# EAGLE design espurna-wd (EAGLE 9.4.2)
PROJECT_AUTHOR: tinkerman.cat <xose.perez@gmail.com>; PROJECT_LICENSE: CC-BY-SA 4.0; PROJECT_NAME: ESPURNA-H; PROJECT_VERSION: 0.8.20171028
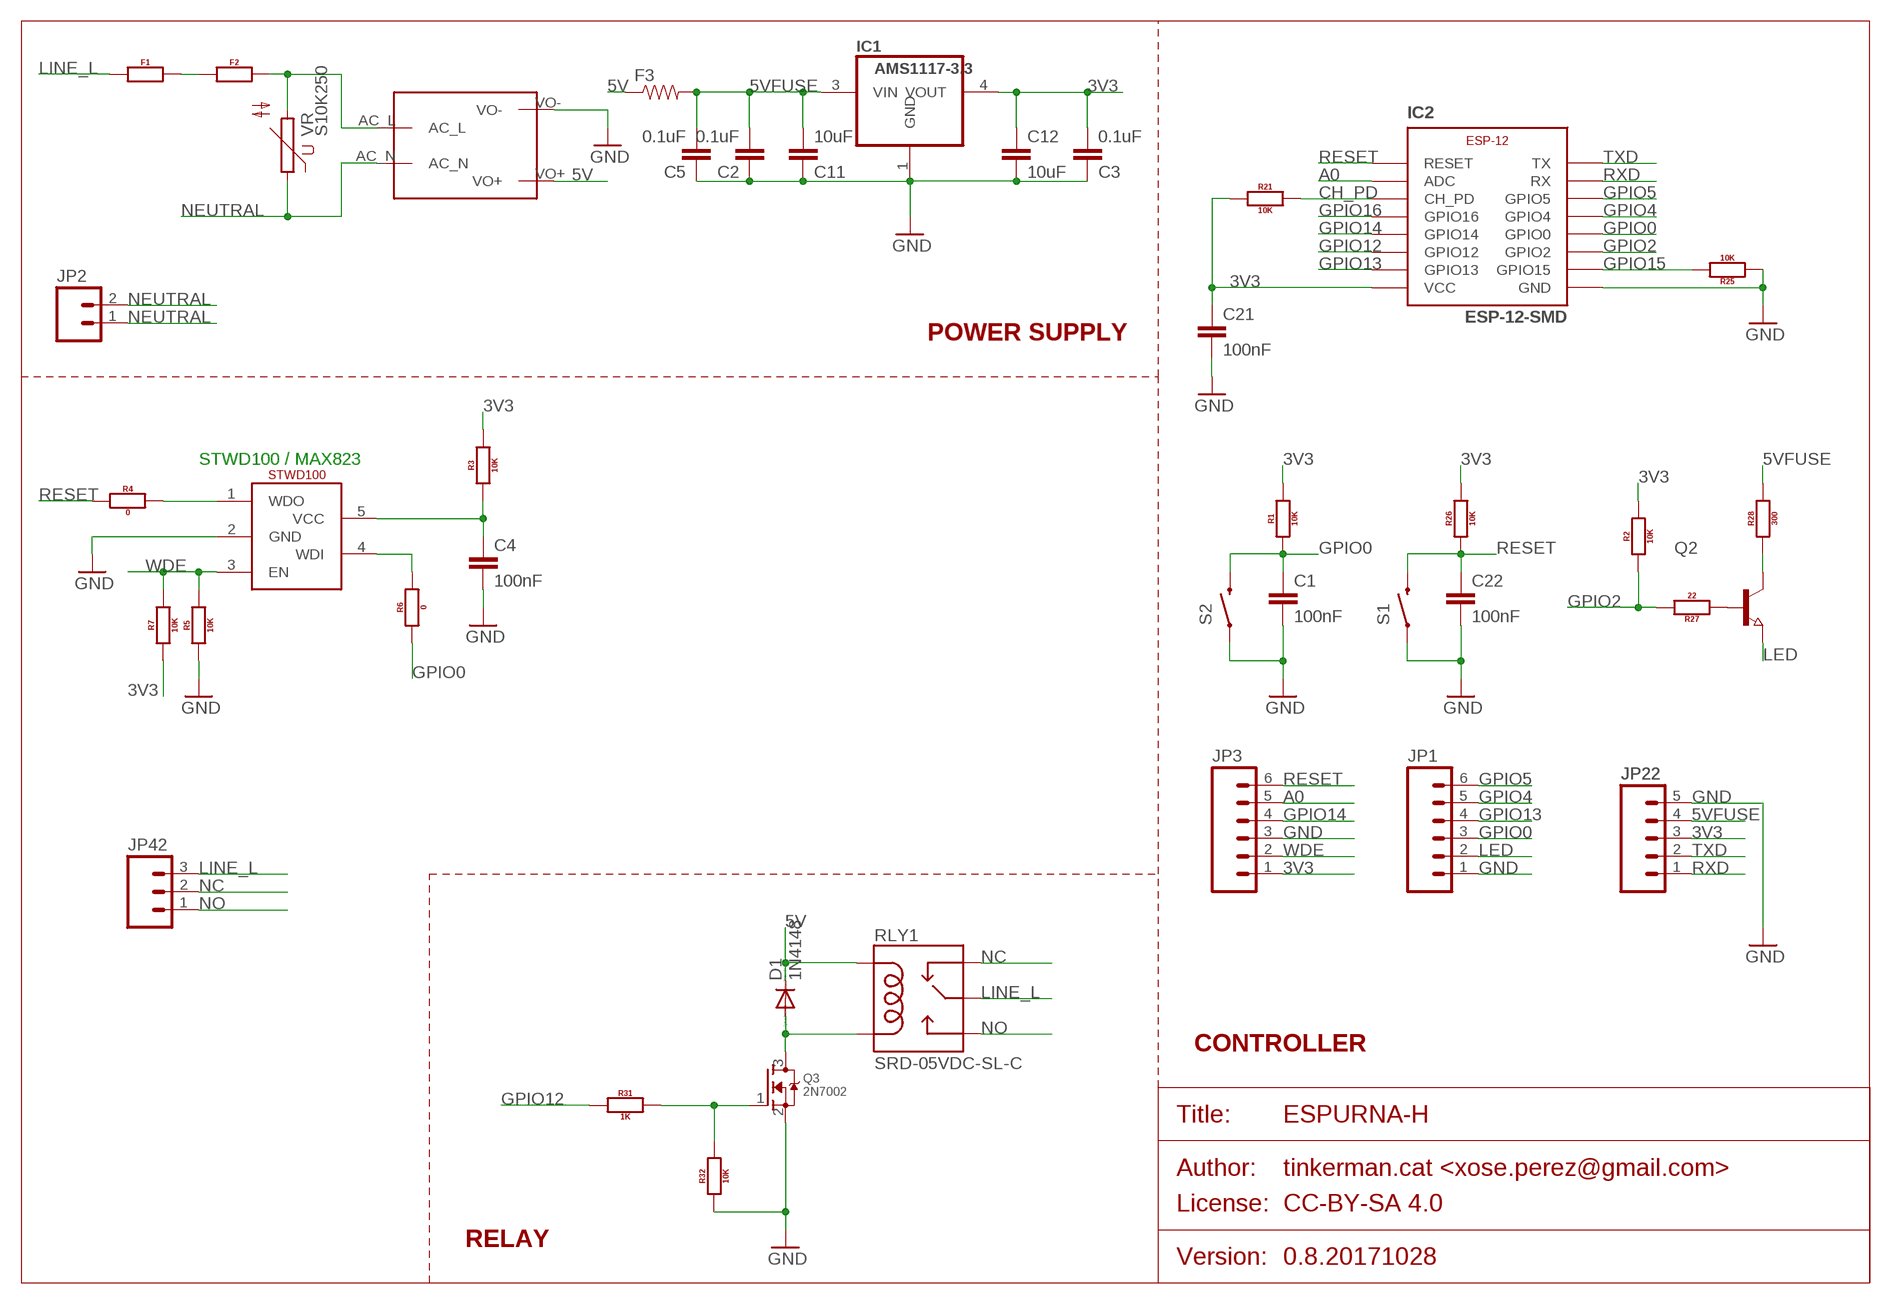
[diagram p0: schematic, sheet 1]

## Parts
C1  100nF  C-EU0805  [0805]
C2  0.1uF  C-EUC1206K  [C1206K]
C3  0.1uF  C-EU0805  [0805]
C4  100nF  C-EU0805  [0805]
C5  0.1uF  C-EU0805  [0805]
C11  10uF  C-EUC1206K  [C1206K]
C12  10uF  C-EUC1206  [C1206]
C21  100nF  C-EU0805  [0805]
C22  100nF  C-EU0805  [0805]
D1  1N4148  DIODE-DO214BA  [DO214BA]
F1  THERMALFUSE0.4  [AXIAL-0.4]
F2  THERMALFUSE0.4  [AXIAL-0.4]
F3  RESISTOR1206  [1206]
IC1  AMS1117-3.3  REG1117SOT223-2  [SOT223]
IC2  ESP-12-SMD  [ESP-12-SMD]
JP1  M06NO_SILK_FEMALE_PTH  [1X06_NO_SILK]
JP2  M02200MIL  [SCREWTERMINAL-200MIL-2]
JP3  M06NO_SILK_FEMALE_PTH  [1X06_NO_SILK]
JP22  M05PTH  [1X05]
JP42  M03200MIL  [SCREWTERMINAL-200MIL-3]
Q2  NPN-TRANSISTOR_SOT23  [SOT23]
Q3  2N7002  MOSFET-NREFLOW  [SOT23]
R1  10K  RESISTOR0805  [0805]
R2  10K  RESISTOR0805  [0805]
R3  10K  RESISTOR0805  [0805]
R4  0  RESISTOR0805  [0805]
R5  10K  RESISTOR0805  [0805]
R6  0  RESISTOR0805  [0805]
R7  10K  RESISTOR0805  [0805]
R21  10K  RESISTOR0805  [0805]
R25  10K  RESISTOR0805  [0805]
R26  10K  RESISTOR0805  [0805]
R27  22  RESISTOR0805  [0805]
R28  300  RESISTOR0805  [0805]
R31  1K  RESISTOR0805  [0805]
R32  10K  RESISTOR0805  [0805]
RLY1  SRD-05VDC-SL-C  RELAYSONGLE  [SRD-5VDC-SL-C]
S1  SWITCH-MOMENTARY-2SMD-1101NE  [TACTILE-SWITCH-1101NE]
S2  SWITCH-MOMENTARY-2SMD-1101NE  [TACTILE-SWITCH-1101NE]
U$1  MAINS_CONVERTERS  [HLK-PM01]
VR  S10K250  [S10K250]
WD  STWD100  [SOT95P280X145-5N]

## Nets
3V3: C3.2 C12.1 C21.1 IC1.4(VOUT) IC2.VCC JP3.1 JP22.3 R1.2 R2.2 R3.2 R7.1 R21.1 R26.2
5V: D1.C F3.1 RLY1.COIL1 U$1.VO+
5VFUSE: C2.2 C5.2 C11.2 F3.2 IC1.3(VIN) JP22.4 R28.2
A0: IC2.ADC JP3.5
CH_PD: IC2.CH_PD R21.2
GND: C1.2 C2.1 C3.1 C4.2 C5.1 C11.1 C12.2 C21.2 C22.2 IC1.1(GND) IC2.GND JP1.1 JP3.3 JP22.5 Q3.2(S) R5.1 R25.1 R32.1 S1.1 S2.1 U$1.VO- WD.2(GND)
GPIO0: C1.1 IC2.GPIO0 JP1.3 R1.1 R6.1 S2.2
GPIO2: IC2.GPIO2 R2.1 R27.2
GPIO4: IC2.GPIO4 JP1.5
GPIO5: IC2.GPIO5 JP1.6
GPIO12: IC2.GPIO12 R31.1
GPIO13: IC2.GPIO13 JP1.4
GPIO14: IC2.GPIO14 JP3.4
GPIO15: IC2.GPIO15 R25.2
GPIO16: IC2.GPIO16
LED: JP1.2 Q2.2(E)
LINE_L: F1.P$1 JP42.3 RLY1.COMMON(MAIN)
LINE_P: F2.P$2 U$1.AC_L VR.2
N$1: Q2.3(C) R28.1
N$3: Q2.1(B) R27.1
N$4: D1.A Q3.3(D) RLY1.COIL2
N$5: Q3.1(G) R31.2 R32.2
N$6: C4.1 R3.1 WD.5(VCC)
N$7: F1.P$2 F2.P$1
N$8: R4.2 WD.1(WDO)
N$10: R6.2 WD.4(WDI)
NC: JP42.2 RLY1.CLOSED(NC)
NEUTRAL: JP2.1 JP2.2 U$1.AC_N VR.1
NO: JP42.1 RLY1.OPEN(NO)
RESET: C22.1 IC2.RESET JP3.6 R4.1 R26.1 S1.2
RXD: IC2.RX JP22.1
TXD: IC2.TX JP22.2
WDE: JP3.2 R5.2 R7.2 WD.3(EN)

## Notes on the sheet
- POWER SUPPLY
- STWD100 / MAX823
- CONTROLLER
- RELAY

## Library data of the parts
C1-C5 C11 C12 C21 C22 = xose:C-EU: CAPACITOR, European symbol
D1 = diode:DIODE-: DIODE
F1 F2 = xose:THERMALFUSE
F3 = SparkFun-Passives:RESISTOR: Resistor Basic schematic elements and footprints for 0603, 1206, and PTH resistors.
IC1 = xose:REG1117: 800mA and 1A Low Dropout (LDO) Positive Regulator 1.8V, 2.5V, 2.85V, 3.3V, 5V, and Adj
IC2 = xose:ESP-12
JP1 JP3 = SparkFun-Connectors:M06: Header 6 Standard 6-pin 0.1" header. Use with straight break away headers (SKU : PRT-00116), right angle break away headers (PRT-00553), swiss pins (PRT-00743), machine pins (PRT-00117), and female headers (PRT-00115). Molex polarized connector foot print use with SKU : PRT-08094 with associated crimp pins and housings. NOTES ON THE VARIANTS LOCK and LOCK_LONGPADS... This footprint was designed to help hold the alignment of a through-hole component (i.e. 6-pin header) while soldering it into place. You may notice that each hole has been shifted either up or down by 0.005 of an inch from it's more standard position (which is a perfectly straight line). This slight alteration caused the pins (the squares in the middle) to touch the edges of the holes. Because they are alternating, it causes a "brace" to hold the component in place. 0.005 has proven to be the perfect amount of "off-center" position when using our standard breakaway headers. Although looks a little odd when you look at the bare footprint, once you have a header in there, the alteration is very hard to notice. Also,if you push a header all the way into place, it is covered up entirely on the bottom side. This idea of altering the position of holes to aid alignment will be further integrated into the Sparkfun Library for other footprints. It can help hold any component with 3 or more connection pins.; PROD_ID: CONN-08437
JP2 = xose:M02: Standard 2-pin 0.1" header. Use with - straight break away headers ( PRT-00116) - right angle break away headers (PRT-00553) - swiss pins (PRT-00743) - machine pins (PRT-00117) - female headers (PRT-00115) Molex polarized connector foot print use with: PRT-08233 with associated crimp pins and housings. 2.54_SCREWTERM for use with PRT-10571. 3.5mm Screw Terminal footprints for PRT-08084 5mm Screw Terminal footprints for use with PRT-08432
JP22 = xose:M05: Header 5 Standard 5-pin 0.1" header. Use with straight break away headers (SKU : PRT-00116), right angle break away headers (PRT-00553), swiss pins (PRT-00743), machine pins (PRT-00117), and female headers (PRT-00115). Molex polarized connector foot print use with SKU : PRT-08230 with associated crimp pins and housings.
JP42 = xose:M03: Header 3 Standard 3-pin 0.1" header. Use with straight break away headers (SKU : PRT-00116), right angle break away headers (PRT-00553), swiss pins (PRT-00743), machine pins (PRT-00117), and female headers (PRT-00115). Molex polarized connector foot print use with SKU : PRT-08232 with associated crimp pins and housings.
Q2 = xose:NPN-TRANSISTOR_: NPN TRANSISTOR
Q3 = xose:MOSFET-N: N-Channel Mosfet 2N7002E - 60V 260mA SOT23 [Digikey: 2N7002ET1GOSTR-ND] - REEL BSH103 - 30V 850mA SOT23 [Digikey: 568-5013-1-ND]
R1-R7 R21 R25-R28 R31 R32 = xose:RESISTOR: Generic EU resistor symbol
RLY1 = Spark:RELAY: SPDT relay (COM-00101)
S1 S2 = SparkFun-Electromechanical:SWITCH-MOMENTARY-2: Various NO switches- pushbuttons, reed, etc; PROD_ID: SWCH-00815
U$1 = captain-slow:MAINS_CONVERTERS
VR = xose:S10K250: VARISTOR
WD = SOT95P280X145-5N:STWD100

## Board
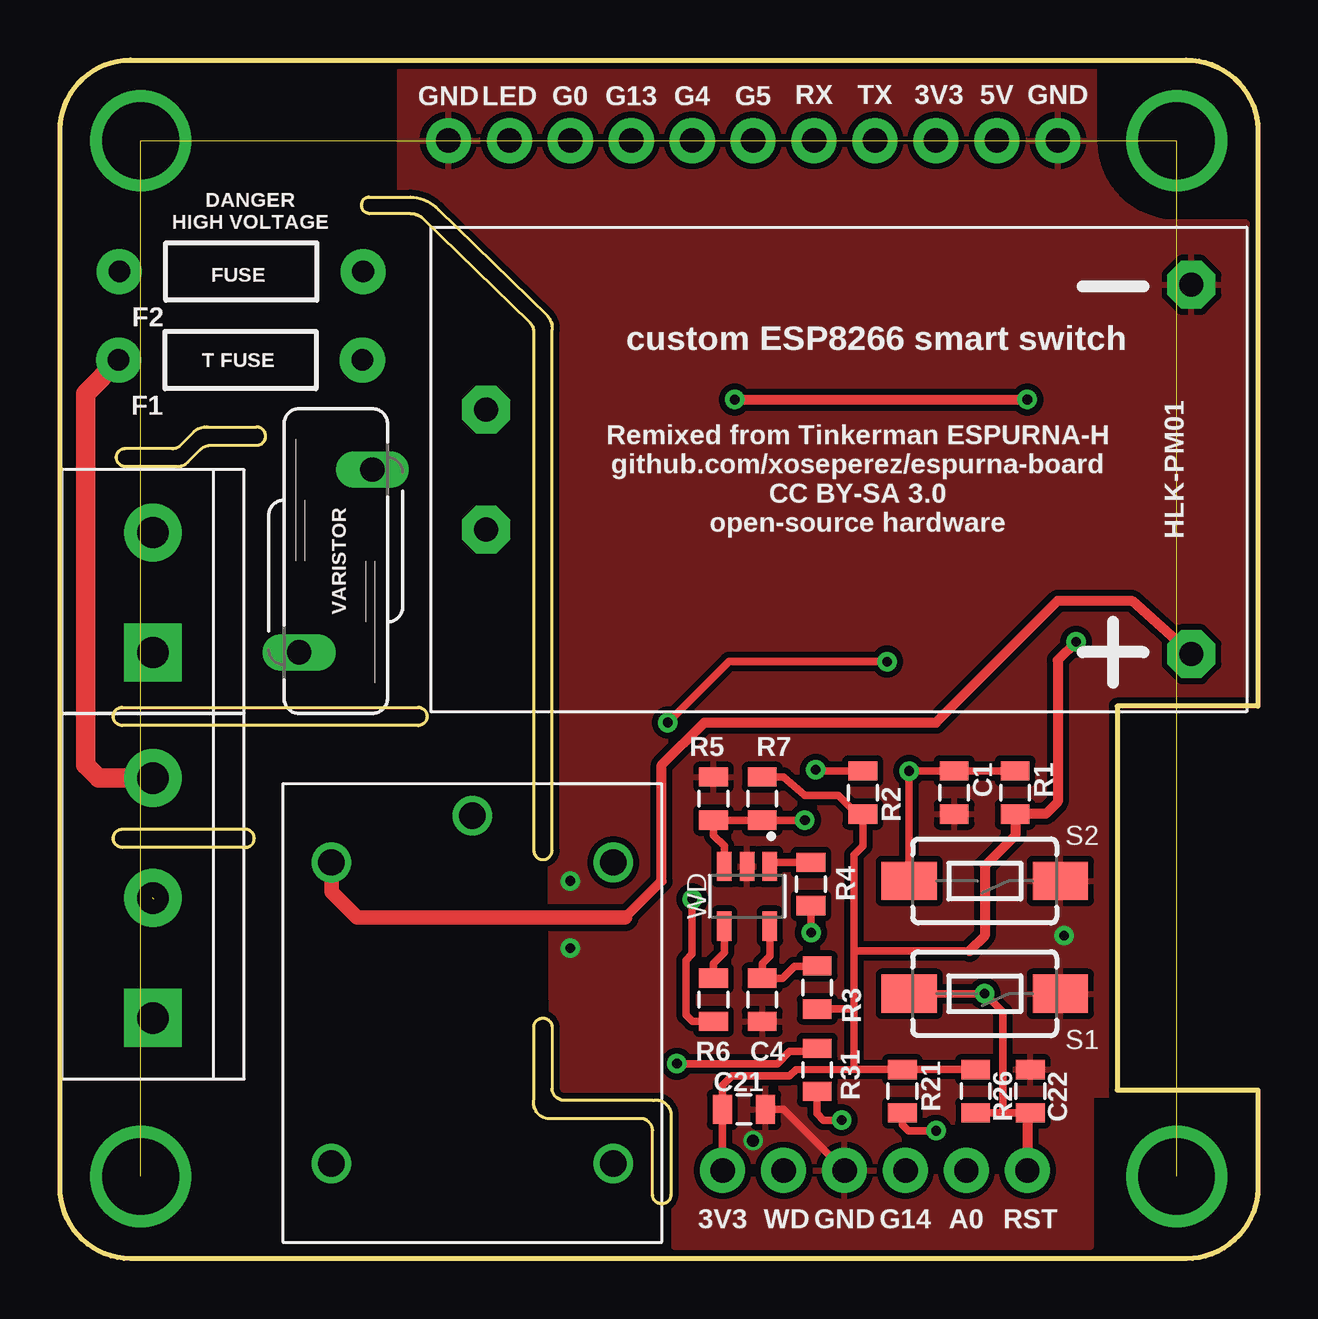
[diagram p1: board, top side]
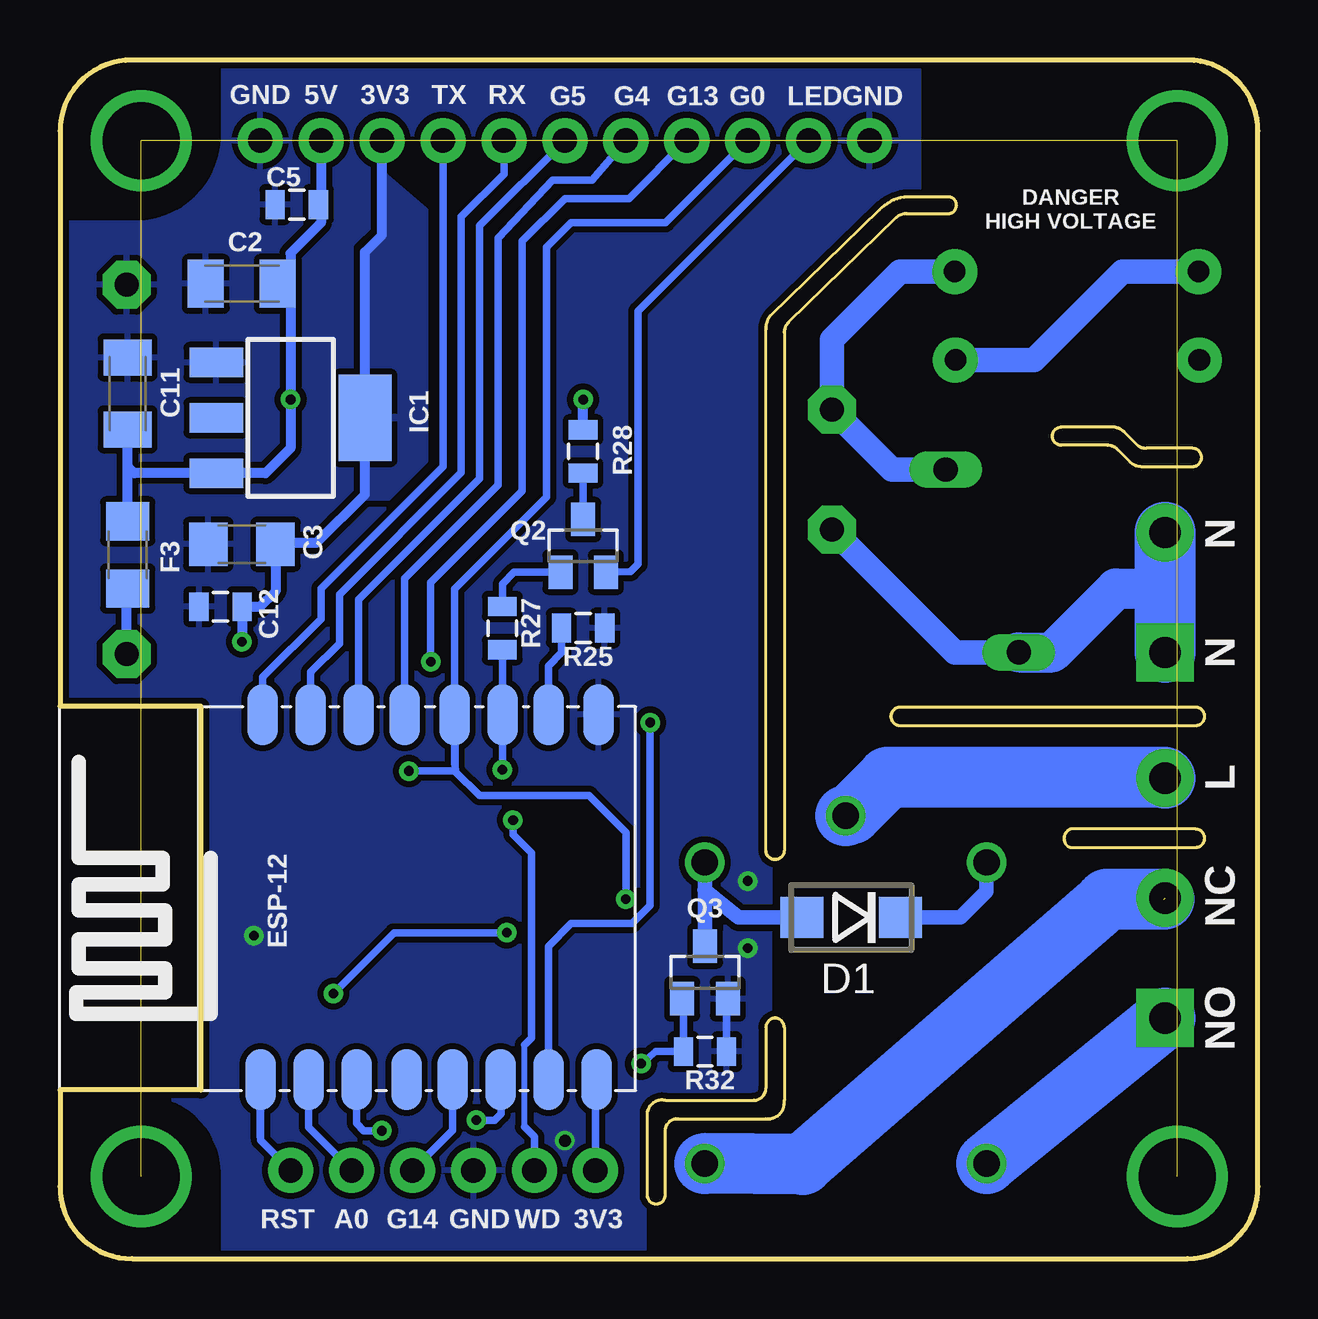
[diagram p2: board, bottom side, seen from below]

Size 49.94 x 49.97 mm. Coordinates in mm from the lower left corner, seen from the top.
Outline: 20.51,38.73 20.51,17.02 arc-180 19.75,17.02 19.75,38.6
Outline: 20.51,38.73 20.51,38.73
Outline: 19.75,38.61 19.75,38.6
Outline: 14.91,22.23 2.6,22.23 arc-90 2.22,22.61 arc-90 2.6,22.99 14.92,22.99 arc-90 15.3,22.61 arc-90 14.92,22.23
Outline: 20.51,38.73 arc45 20.32,39.3 15.77,43.73 arc45 14.6,44.26 12.89,44.26 arc90 12.57,43.94 arc90 12.89,43.56 14.61,43.56 arc-45 15.11,43.38 19.56,39.05 arc-45 19.75,38.6
Outline: 0,3 0,47 arc-90 2.94,49.97 46.94,49.97 arc-90 49.94,47 49.94,23.03 44.06,23.03 44.06,7.03 49.94,7.03 49.94,3 arc-90 46.94,0 2.94,0 arc-90 0,3
Outline: 19.75,9.65 arc-180 20.51,9.65 20.51,7.11 arc90 21.02,6.6 24.7,6.6 arc-90 25.46,6.1 25.46,2.67 arc-180 24.7,2.67 24.7,5.33 arc90 24.19,5.84 20.51,5.84 arc-106 19.75,6.6 19.75,9.65
Outline: 2.6,17.91 7.81,17.91 arc-90 8.06,17.4 arc-90 7.68,17.14 2.6,17.14 arc-90 2.22,17.53 arc-90 2.6,17.91
Outline: 2.73,33.78 4.64,33.78 arc45 4.98,33.87 5.59,34.48 arc-45 6.17,34.67 8.19,34.67 arc-90 8.57,34.29 arc-90 8.19,33.91 6.3,33.91 arc45 5.85,33.72 5.33,33.21 arc-45 4.88,33.02 2.73,33.02 arc-90 2.35,33.4 arc-90 2.73,33.78
Copper layers (1*16): Top 0.035mm / dielectric 1.5mm / Bottom 0.035mm
Design rules "seedstudio-2layer": minimum track width 6mil, minimum drill 12mil, track to track 6mil, track to pad 6mil, pad to pad 6mil, via to via 6mil, smd to smd 0mil, copper to edge 10mil, drill to drill 10mil, minimum pad ring 10mil, minimum via ring 6mil, stop-mask expansion 2mil, vias tented up to drill 100mil, thermal gap 10mil

### Footprints (pad centres in the part's own frame; a part is rotated, then mirrored left to right if it is on the bottom)
0805 = smd 0.8 x 1.2: 1 -0.9,0; 2 0.9,0
C1206K = smd 1.5 x 2: 1 -1.5,0; 2 1.5,0
C1206 = smd 1.6 x 1.8: 1 -1.4,0; 2 1.4,0
DO214BA = smd 1.8 x 1.7: A 2.05,0; C -2.05,0
AXIAL-0.4 = drill 0.9 pad 1.88: P$1 -5.08,0; P$2 5.08,0
1206 = smd 1.6 x 1.8: 1 -1.4,0; 2 1.4,0
SOT223 = smd 1.219 x 2.235: 1 -2.311,-3.099; 2 0,-3.099; 3 2.311,-3.099 | smd 3.6 x 2.2: 4 0,3.099
ESP-12-SMD = smd 2.54 x 1.27: ADC -7,5.1; CH_PD -7,3.1; GND 8.2,-7; GPIO0 8.2,-1; GPIO2 8.2,-3; GPIO4 8.2,1.1; GPIO5 8.2,3; GPIO12 -7,-2.9; GPIO13 -7,-4.9; GPIO14 -7,-0.9; GPIO15 8.2,-4.9; GPIO16 -7,1; RESET -7,7.1; RX 8.2,5; TX 8.2,7; VCC -7,-6.9
1X06_NO_SILK = drill 1.016 pad 1.88: 1 0,0; 2 2.54,0; 3 5.08,0; 4 7.62,0; 5 10.16,0; 6 12.7,0
SCREWTERMINAL-200MIL-2 = drill 1.3 pad 2.413 square: 1 0,0 | drill 1.3 pad 2.413: 2 5,0
1X05 = drill 1.016 pad 1.88: 1 0,0; 2 2.54,0; 3 5.08,0; 4 7.62,0; 5 10.16,0
SCREWTERMINAL-200MIL-3 = drill 1.3 pad 2.413 square: 1 0,0 | drill 1.3 pad 2.413: 2 5,0; 3 10,0
SOT23 = smd 1 x 1.4: 1 -0.95,-1.1; 2 0.95,-1.1; 3 0,1.1
SRD-5VDC-SL-C = drill 1.1: CLOSED -6.275,-5.875; COIL1 6.275,5.875; COIL2 6.275,-5.875; COMMON 8.225,0; OPEN -6.275,5.875
TACTILE-SWITCH-1101NE = smd 2.3 x 1.6: 1 -3.15,0; 2 3.15,0
HLK-PM01 = drill 1 pad 2 octagon: AC_L -14.7,2.5; AC_N -14.7,-2.5; VO+ 14.7,-7.7; VO- 14.7,7.7
S10K250 = drill 1.016 long: 1 -1.524,-3.81; 2 1.524,3.81
SOT95P280X145-5N = smd 1.22 x 0.6: 1 -1.245,0.95; 2 -1.245,0; 3 -1.245,-0.95; 4 1.245,-0.95; 5 1.245,0.95

### Placement (x,y rotation side)
C1  37.27,19.43 270 top
C2  42.35,40.64 0 bottom
C3  43.24,27.18 0 bottom
C4  29.27,10.79 270 top
C5  40.07,43.94 0 bottom
C11  47.12,36.07 270 bottom
C12  42.35,29.78 180 bottom
C21  28.51,6.22 0 top
C22  40.45,6.99 90 top
D1  16.95,14.22 180 bottom
F1  7.53,37.47 0 top
F2  7.56,41.15 0 top
F3  47.12,29.34 90 bottom
IC1  40.32,35.05 270 bottom
IC2  34.48,14.48 90 bottom
JP1  16.19,46.61 0 top
JP2  3.87,25.27 90 top
JP3  27.62,3.68 0 top
JP22  31.43,46.61 0 top
JP42  3.87,10.03 90 top
Q2  28.13,29.72 0 bottom
Q3  23.05,11.94 0 bottom
R1  39.81,19.43 270 top
R2  33.46,19.43 270 top
R3  31.56,11.3 270 top
R4  31.31,15.62 90 top
R5  27.24,19.18 270 top
R6  27.24,10.79 90 top
R7  29.27,19.18 270 top
R21  35.12,6.99 270 top
R25  28.13,26.29 180 bottom
R26  38.16,6.99 90 top
R27  31.5,26.29 270 bottom
R28  28.13,33.66 90 bottom
R31  31.56,7.87 90 top
R32  23.05,8.64 180 bottom
RLY1  17.19,10.25 90 top
S1  38.54,11.05 180 top
S2  38.54,15.75 180 top
U$1  32.46,32.9 0 top
VR  11.49,29.08 0 top
WD  28.64,15.11 270 top

### Tracks (layer width: path | path; a pad name or v marks a point on that pad's centre or on a via)
3V3  (via drill 0.4 pad 0.81)
  Top 0.305: JP3.1 27.62,6.09 C21.1 27.61,7.23 28.01,7.63 28.28,7.62 30.42,7.62 30.67,7.87 33.08,7.88 | R26.2 R21.1 33.08,7.88 | 37.91,12.83 33.08,12.83 | 33.08,12.83 33.08,10.41 | 33.08,10.41 33.08,7.88 | 33.08,12.83 33.08,16.83 33.46,17.21 R2.2 33.22,18.53 32.45,19.3 31.05,19.3 30.15,20.08 R7.1 | R3.2 31.32,10.41 33.08,10.41
  Top 0.406: 37.91,12.83 38.54,13.46 38.54,16.38 39.81,17.65 R1.2 39.83,18.54 41.08,18.54 41.59,19.05 41.59,24.96 v42.35,25.72
  Bottom 0.305: IC2.VCC 27.48,7.64 27.62,7.5 JP3.1
  Bottom 0.406: JP22.3 36.51,42.67 37.22,41.96 IC1.4 37.22,31.86 39.24,29.84 40.7,29.84 C12.1 40.95,27.82 41.59,27.18 C3.2 42.34,25.98 v42.35,25.72
  pour Bottom (isolate 0.406, rank 2): 37.27,31.75 36.26,31.75 34.73,33.27 34.73,43.69 36.51,45.21 36.51,42.67 37.27,41.91
5V
  Top 0.406: 23.56,14.22 25.08,15.75 25.08,20.57 26.86,22.35 36.51,22.35 41.59,27.43 44.68,27.43 U$1.VO+
  Top 0.61: RLY1.COIL1 11.32,15.29 12.38,14.22 23.56,14.22
  Bottom 0.406: U$1.VO+ 47.16,27.89 F3.1 | RLY1.COIL1
  Bottom 0.61: D1.C 12.41,14.22 11.32,15.32 RLY1.COIL1
5VFUSE  (via drill 0.4 pad 0.81)
  Top 0.406: v28.13,35.81 v40.32,35.81
  Bottom 0.406: F3.2 47.12,33.02 | 47.12,33.02 C11.2 | 47.12,33.02 46.84,32.74 IC1.3 41.36,32.74 40.32,33.78 v40.32,35.81 40.32,40.13 | JP22.4 39.05,43.94 | 40.32,40.13 40.32,41.91 39.05,43.18 39.05,43.69 39.05,43.94 | C2.2 40.32,40.13 | R28.2 v28.13,35.81 | C5.2 39.05,43.94
A0
  Bottom 0.305: IC2.ADC 39.58,5.48 JP3.5
CH_PD  (via drill 0.4 pad 0.81)
  Top 0.305: v36.51,5.33 35.37,5.33 35.12,5.59 R21.2
  Bottom 0.305: IC2.CH_PD 37.58,5.64 37.27,5.33 v36.51,5.33
GND  (via drill 0.4 pad 0.81, 0.5 pad 0.81)
  Top 0.305: C21.2 30.16,6.22 JP3.3
  Bottom 0.305: R32.1 22.15,10.79 Q3.2
  other vias: 41.85,13.46 28.89,4.92 21.27,12.95 21.27,15.75
  pour Bottom (isolate 0.254, rank 6): 43.12,49.78 14.16,49.78 14.16,44.2 15.43,44.2 20.26,39.37 20.38,6.22 25.59,6.1 25.59,0 43.12,0 43.12,3.56 arc-90 46.42,6.86 49.97,6.86 49.97,43.18 46.67,43.18 arc-90 43.12,46.99
  pour Top (isolate 0.254, rank 2): 43.12,49.53 15.43,49.53 14.16,49.53 14.16,44.2 15.43,44.2 20.26,39.37 20.51,6.73 25.59,6.73 25.59,0.51 42.99,0.51 42.99,6.86 44.13,6.86 43.75,23.37 49.59,23.37 49.47,43.18 46.55,43.18 arc-90 43.12,46.61
GPIO0  (via drill 0.4 pad 0.81)
  Top 0.305: R1.1 C1.1 v35.39,20.33 S2.2 | R6.1 26.36,9.89 26.1,10.16 26.1,12.45 26.35,12.7 v26.35,14.99
  Bottom 0.305: v35.39,20.33 33.45,20.33 33.48,20.68 IC2.GPIO0 | IC2.GPIO0 33.48,27.92 29.65,31.75 29.65,42.16 28.64,43.18 24.7,43.18 JP1.3 | v26.35,14.99 26.35,17.78 27.88,19.3 32.45,19.3 33.46,20.32 33.46,22.1 33.48,22.11 IC2.GPIO0
GPIO2  (via drill 0.4 pad 0.81)
  Top 0.305: R2.1 31.55,20.33 v31.5,20.38
  Bottom 0.305: v31.5,20.38 31.5,22.66 IC2.GPIO2 31.5,22.68 R27.2
GPIO4
  Bottom 0.305: IC2.GPIO4 35.58,28.36 31.69,32.26 31.69,42.55 29.4,44.96 27.75,44.96 JP1.5
GPIO5
  Bottom 0.305: IC2.GPIO5 37.48,27.48 32.45,32.51 32.45,43.05 JP1.6
GPIO12  (via drill 0.4 pad 0.81)
  Top 0.305: R31.1 31.56,6.06 31.81,5.78 v32.58,5.78
  Bottom 0.305: v32.58,5.78 31.81,5.78 31.56,6.03 31.56,7.2 IC2.GPIO12
GPIO13  (via drill 0.4 pad 0.81)
  Top 0.305: v25.34,22.35 27.88,24.89 v34.48,24.89 34.58,24.89
  Bottom 0.305: 29.58,6.8 IC2.GPIO13 29.58,13.03 28.64,13.97 26.1,13.97 25.34,14.73 v25.34,22.35 | v34.48,24.89 34.48,28.19 30.67,32 30.67,42.42 28.89,44.2 26.23,44.2 JP1.4
GPIO14
  Bottom 0.305: IC2.GPIO14 33.58,5.34 JP3.4
GPIO15
  Bottom 0.305: IC2.GPIO15 29.58,24.71 29.03,25.26 R25.2
LED
  Bottom 0.305: Q2.2 26.16,28.64 25.84,28.96 25.84,39.5 JP1.2
LINE_L
  Top 0.813: JP42.3 1.62,20.03 1.08,20.57 1.08,36.07 F1.P$1
  Bottom 0.203: 17.21,18.2 RLY1.COMMON
  Bottom 2.54: JP42.3 3.91,20.07 15.43,20.07 16.94,18.56 RLY1.COMMON
LINE_P
  Bottom 1.016: F2.P$2 14.92,41.15 17.76,38.31 U$1.AC_L 15.25,32.89 VR.2
N$1
  Bottom 0.305: Q2.3 R28.1
N$3
  Bottom 0.305: Q2.1 31.01,28.62 31.5,28.13 R27.1
N$4
  Bottom 0.305: 23.05,16.51 RLY1.COIL2
  Bottom 0.406: RLY1.COIL2 23.07,15.38
  Bottom 0.61: 23.07,15.38 21.65,14.22 D1.A | Q3.3 23.05,16.51
N$5  (via drill 0.4 pad 0.81)
  Top 0.305: R31.2 31.57,8.65 30.42,8.64 29.91,8.13 v25.72,8.13
  Bottom 0.305: 24.04,10.79 Q3.1 23.95,10.79 R32.2 25.08,8.64 v25.72,8.13
N$6
  Top 0.305: WD.5 29.59,12.63 29.27,12.32 C4.1 30.11,11.7 30.61,12.19 31.29,12.19 R3.1
N$7
  Bottom 1.016: F1.P$2 9.33,37.47 5.65,41.15 F2.P$1
N$8
  Top 0.305: R4.2 29.59,16.52 WD.1
N$10
  Top 0.305: WD.4 27.69,12.77 27.24,12.32 R6.2
NC  (1 unrouted)
  Bottom 2.54: 3.92,14.99 6.29,14.99 6.41,14.86 18.99,3.94 RLY1.CLOSED
NEUTRAL
  Bottom 1.016: VR.1 12.63,25.27 U$1.AC_N
  Bottom 1.676: VR.1 8.57,25.27 5.91,27.94 3.87,27.94
  Bottom 2.54: JP2.1 3.87,27.94 JP2.2
NO
  Bottom 2.54: JP42.1 RLY1.OPEN
NONAME  (via drill 3.2)  (3 unrouted)
  other vias: 3.37,46.61 46.55,46.61 46.55,3.43 3.37,3.43
RESET  (via drill 0.4 pad 0.81)
  Top 0.305: R26.1 39.31,6.08 | 39.31,6.08 C22.1 40.32,6.08 | 39.31,6.08 39.31,10.29 v38.54,11.05 S1.2 | R4.1 v31.31,13.59
  Top 0.406: 40.32,6.08 JP3.6
  Bottom 0.305: JP3.6 41.58,4.94 IC2.RESET 41.59,7.48 41.59,5.08 | v31.31,13.59 36,13.59 v38.54,11.05
RXD
  Bottom 0.305: IC2.RX 39.48,24.46 38.29,25.65 38.29,27.69 33.21,32.77 33.21,43.43 31.43,45.21 JP22.1
TXD
  Bottom 0.305: IC2.TX 41.48,24.24 39.05,26.67 39.05,27.94 33.97,33.02 JP22.2
WDE  (via drill 0.4 pad 0.81)
  Top 0.305: WD.3 27.69,17.21 27.24,17.65 R5.2 R7.2 31.04,18.28 v31.05,18.29
  Bottom 0.254: 30.58,5.49 30.58,8.92
  Bottom 0.305: JP3.2 30.16,5.08 30.58,5.49 | 30.58,8.92 30.29,9.21 30.29,16.92 31.05,17.68 v31.05,18.29

### Text on the board
tPlace: GND | LED | G0 | G13 | G4 | G5 | RX | TX | 3V3 | 5V | GND | 3V3 | WD | GND | G14 | A0 | RST
bPlace: GND | LED | G0 | G13 | G4 | G5 | RX | TX | 3V3 | 5V | GND | N | N | L | NC | NO | 3V3 | WD | GND | G14 | A0 | RST
tNames: DANGER / HIGH VOLTAGE | FUSE | custom ESP8266 smart switch | T FUSE | Remixed from Tinkerman ESPURNA-H / github.com/xoseperez/espurna-board / CC BY-SA 3.0 / open-source hardware | VARISTOR
bNames: DANGER / HIGH VOLTAGE